# Altium schematic sheet OmniBotRemote.SchDoc
size A3
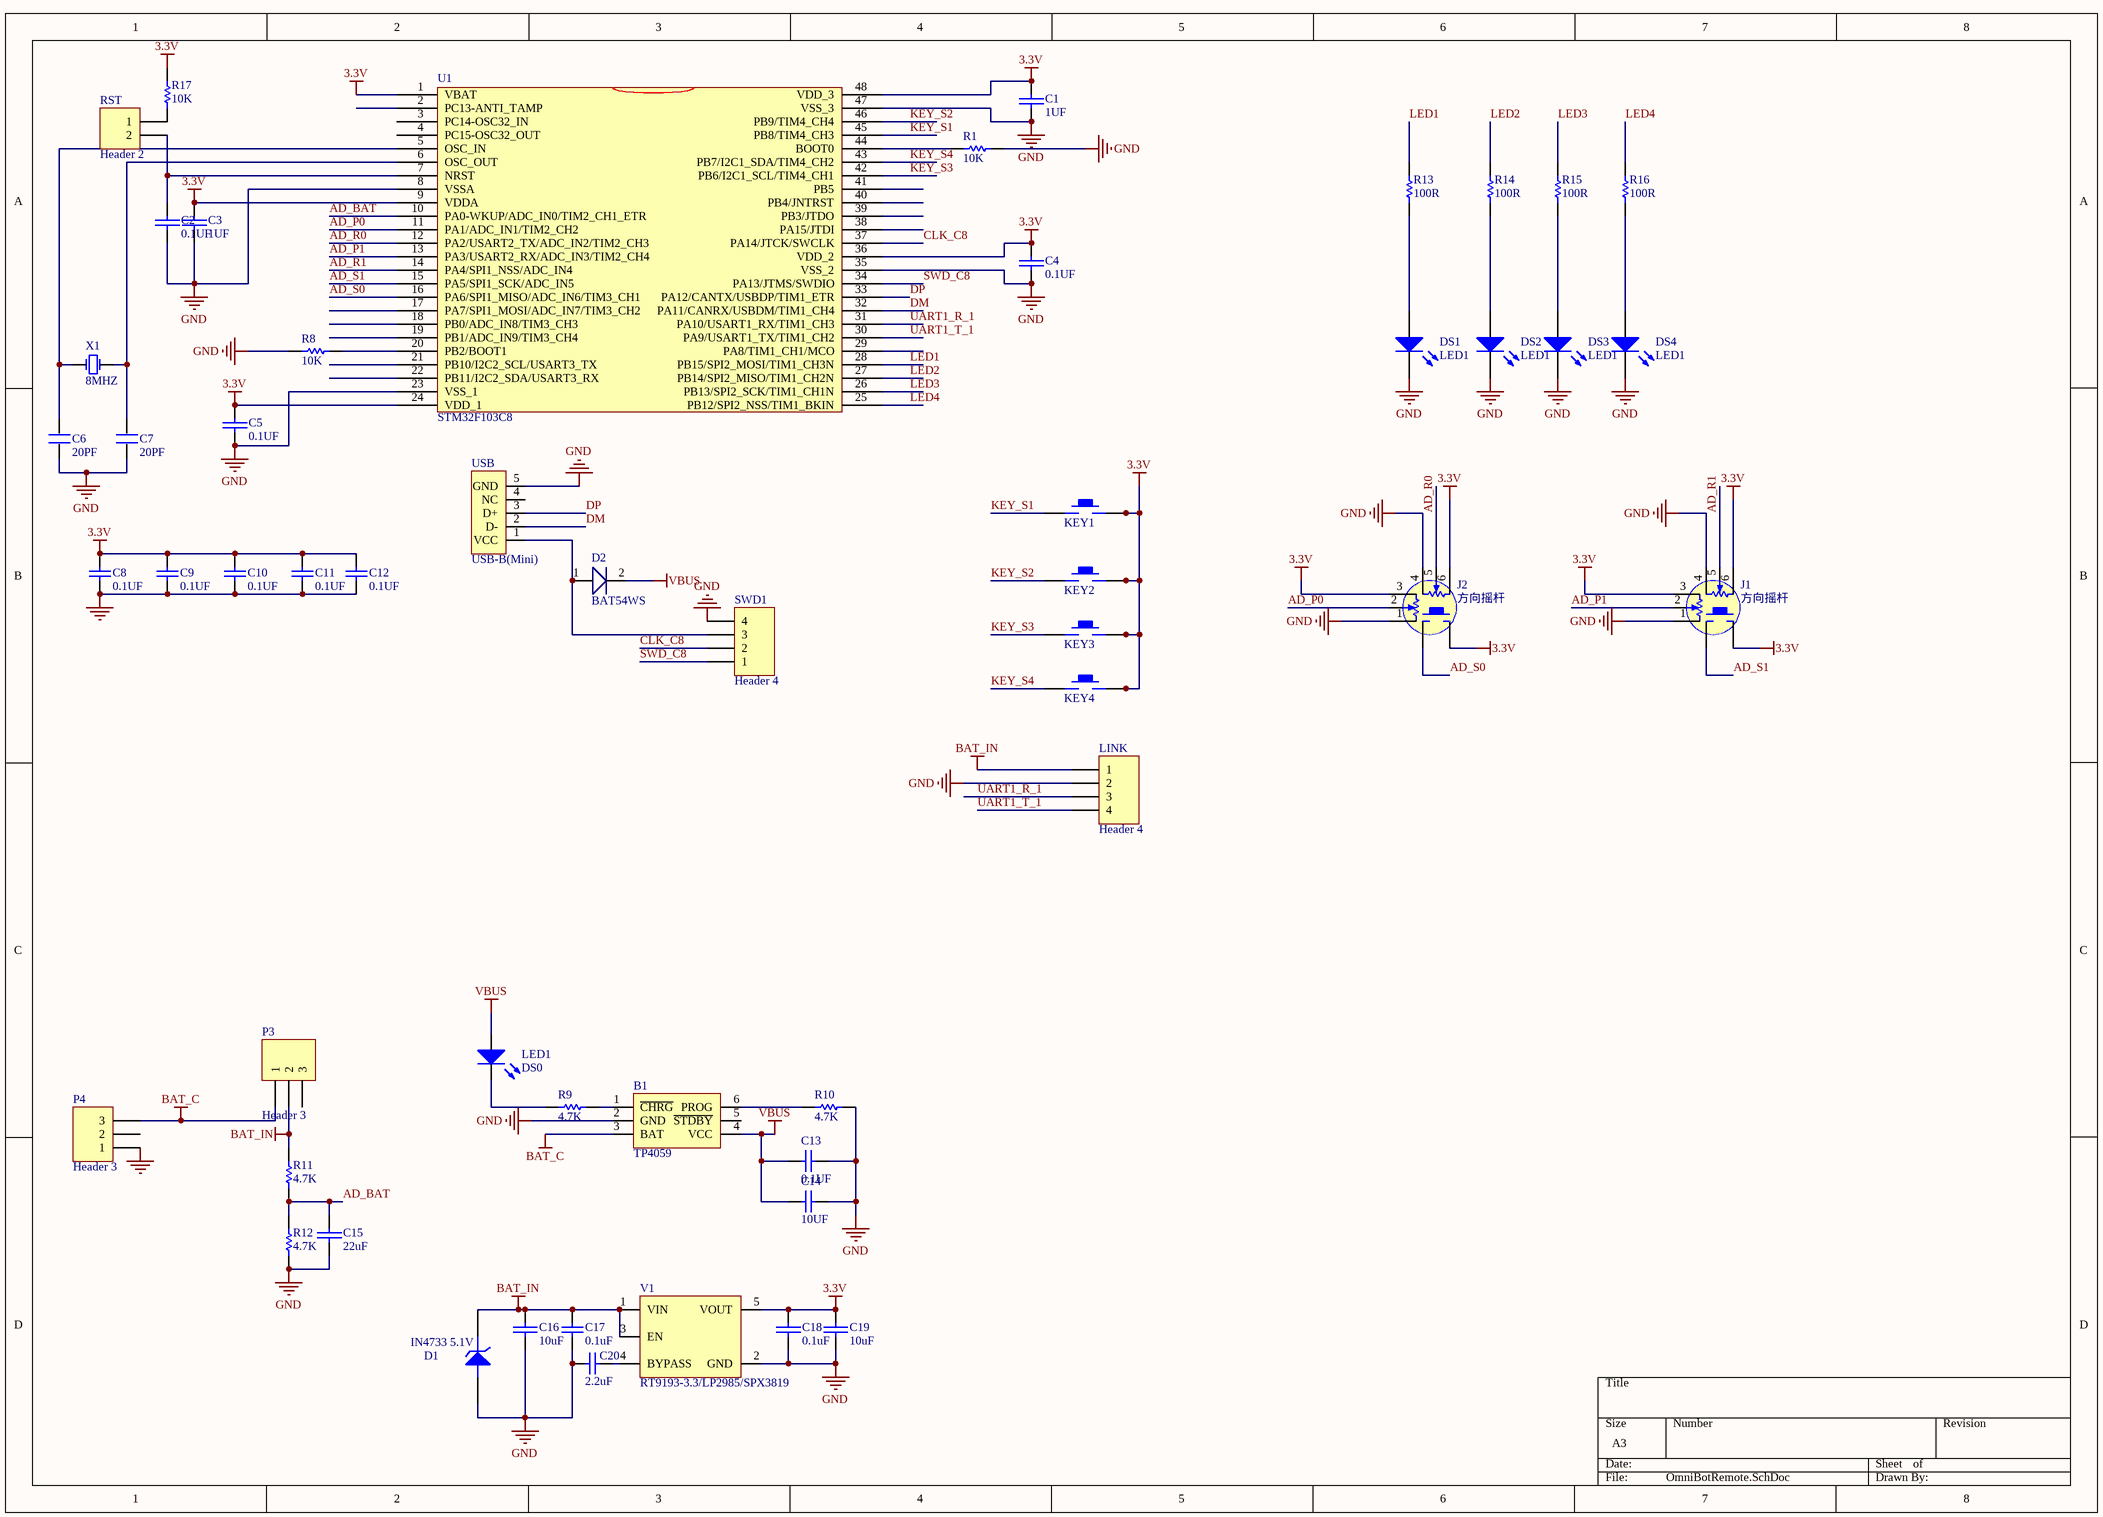
[diagram p0: OmniBotRemote.SchDoc]

## Parts
B1  TP4059  [SOT23-6S]
C1  1UF  [C 0402]
C2  0.1UF  [C 0402]
C3  1UF  [C 0402]
C4  0.1UF  [C 0402]
C5  0.1UF  [C 0402]
C6  20PF  [C 0402]
C7  20PF  [C 0402]
C8  0.1UF  [C 0402]
C9  0.1UF  [C 0402]
C10  0.1UF  [C 0402]
C11  0.1UF  [C 0402]
C12  0.1UF  [C 0402]
C13  0.1UF  [C0603]
C14  10UF  [C0603]
C15  22uF  [C 0402]
C16  10uF  [C0603]
C17  0.1uF  [C 0402]
C18  0.1uF  [C 0402]
C19  10uF  [C0603]
C20  value 2.2uF  [C 0402]  (hidden comment: 0.1uF)
D1  IN4733 5.1V  [1n4148-SOD123]
D2  BAT54WS  [SOD-323]
DS1  LED1  [SMDLED]
DS2  LED1  [SMDLED]
DS3  LED1  [SMDLED]
DS4  LED1  [SMDLED]
J1  方向摇杆  [摇杆2]
J2  方向摇杆  [摇杆2]
KEY1  KEY_M  [KEY_M]  (value not drawn)
KEY2  KEY_M  [KEY_M]  (value not drawn)
KEY3  KEY_M  [KEY_M]  (value not drawn)
KEY4  KEY_M  [KEY_M]  (value not drawn)
LED1  DS0  [LED_0603]
LINK  Header 4  [HDR2X2]
P3  Header 3  [HDR1X3]
P4  Header 3  [HDR1X3]
R1  value 10K  [R 0402]  (hidden comment: 1K)
R8  value 10K  [R 0402]  (hidden comment: 1K)
R9  value 4.7K  [R0603]  (hidden comment: 1K)
R10  value 4.7K  [R0603]  (hidden comment: 1K)
R11  4.7K  [R 0402]
R12  4.7K  [R 0402]
R13  100R  [R0603]
R14  100R  [R0603]
R15  100R  [R0603]
R16  100R  [R0603]
R17  10K  [R0603]
RST  Header 2  [KEY_SAD]
SWD1  Header 4  [SH1.0-4P - up]
U1  STM32F103C8  [LQFP48S]
USB  USB-B(Mini)  [USB/SM0.8-6H5_M]
V1  RT9193-3.3/LP2985/SPX3819  [SOT23-5]
X1  8MHZ  [PXCL]

## Nets
3.3V: C1.2 C3.2 C4.2 C5.2 C8.1 C9.1 C10.1 C11.1 C12.1 C18.1 C19.1 J1.3 J1.6 J1.J1 J2.3 J2.6 J2.J1 KEY1.2 KEY2.2 KEY3.2 KEY4.2 R17.2 U1.1(VBAT) U1.9(VDDA) U1.24(VDD_1) U1.36(VDD_2) U1.48(VDD_3) V1.5(VOUT)
BAT_C: B1.3(BAT) P3.1 P4.3
BAT_IN: C16.1 C17.2 D1.2(K) LINK.1 P3.2 R11.1 V1.1(VIN) V1.3(EN)
GND: B1.2(GND) C1.1 C2.1 C3.1 C4.1 C5.1 C6.1 C7.1 C8.2 C9.2 C10.2 C11.2 C12.2 C13.1 C14.1 C15.2 C16.2 C17.1 C18.2 C19.2 C20.2 D1.1(A) DS1.2(K) DS2.2(K) DS3.2(K) DS4.2(K) J1.1 J1.4 J2.1 J2.4 LINK.2 P4.1 R1.2 R8.1 R10.1 R12.1 SWD1.4 U1.8(VSSA) U1.23(VSS_1) U1.35(VSS_2) U1.47(VSS_3) USB.5(GND) V1.2(GND)
VBUS: B1.4(VCC) C13.2 C14.2 D2.2 LED1.1(A)
AD_BAT: C15.1 R11.2 R12.2 U1.10(PA0-WKUP/ADC_IN0/TIM2_CH1_ETR)
AD_P0: J2.2 U1.11(PA1/ADC_IN1/TIM2_CH2)
AD_P1: J1.2 U1.13(PA3/USART2_RX/ADC_IN3/TIM2_CH4)
AD_R0: J2.5 U1.12(PA2/USART2_TX/ADC_IN2/TIM2_CH3)
AD_R1: J1.5 U1.14(PA4/SPI1_NSS/ADC_IN4)
AD_S0: J2.J2 U1.16(PA6/SPI1_MISO/ADC_IN6/TIM3_CH1)
AD_S1: J1.J2 U1.15(PA5/SPI1_SCK/ADC_IN5)
CLK_C8: SWD1.2 U1.37(PA14/JTCK/SWCLK)
DM: U1.32(PA11/CANRX/USBDM/TIM1_CH4) USB.2(D-)
DP: U1.33(PA12/CANTX/USBDP/TIM1_ETR) USB.3(D+)
KEY_S1: KEY1.1 U1.45(PB8/TIM4_CH3)
KEY_S2: KEY2.1 U1.46(PB9/TIM4_CH4)
KEY_S3: KEY3.1 U1.42(PB6/I2C1_SCL/TIM4_CH1)
KEY_S4: KEY4.1 U1.43(PB7/I2C1_SDA/TIM4_CH2)
LED1: R13.1 U1.28(PB15/SPI2_MOSI/TIM1_CH3N)
LED2: R14.1 U1.27(PB14/SPI2_MISO/TIM1_CH2N)
LED3: R15.1 U1.26(PB13/SPI2_SCK/TIM1_CH1N)
LED4: R16.1 U1.25(PB12/SPI2_NSS/TIM1_BKIN)
SWD_C8: SWD1.1 U1.34(PA13/JTMS/SWDIO)
UART1_R_1: LINK.3 U1.31(PA10/USART1_RX/TIM1_CH3)
UART1_T_1: LINK.4 U1.30(PA9/USART1_TX/TIM1_CH2)
NetB1_1: B1.1(~{CHRG}) R9.1
NetB1_6: B1.6(PROG) R10.2
NetC2_2: C2.2 RST.2 U1.7(NRST)
NetC6_2: C6.2 U1.5(OSC_IN) X1.1(OSC1)
NetC7_2: C7.2 U1.6(OSC_OUT) X1.2(OSC2)
NetC20_1: C20.1 V1.4(BYPASS)
NetD2_1: D2.1 SWD1.3 USB.1(VCC)
NetDS1_1: DS1.1(A) R13.2
NetDS2_1: DS2.1(A) R14.2
NetDS3_1: DS3.1(A) R15.2
NetDS4_1: DS4.1(A) R16.2
NetLED1_2: LED1.2(K) R9.2
NetR1_1: R1.1 U1.44(BOOT0)
NetR8_2: R8.2 U1.20(PB2/BOOT1)
NetR17_1: R17.1 RST.1

Not connected (* = marked no-connect by the designer): B1 5(~{STDBY}); P3 3; P4 2; U1 2(PC13-ANTI_TAMP) 3(PC14-OSC32_IN) 4(PC15-OSC32_OUT) 17(PA7/SPI1_MOSI/ADC_IN7/TIM3_CH2) 18(PB0/ADC_IN8/TIM3_CH3) 19(PB1/ADC_IN9/TIM3_CH4) 21(PB10/I2C2_SCL/USART3_TX) 22(PB11/I2C2_SDA/USART3_RX) 29(PA8/TIM1_CH1/MCO) 38(PA15/JTDI) 39(PB3/JTDO) 40(PB4/JNTRST) 41(PB5); USB 4(NC)

## Library data of the parts
C1-C5 C15 C16 C18 C19 = CAP: Capacitor
C6 C7 = C2: 0805
C8-C14 = CAP: Capacitor; Value: 100nF; Published: 8-Jun-2000; Revision: July-2002: Re-released for DXP Platform.; Publisher: Altium Limited
C17 C20 = Capacitor: 普通电容; Published: 8-Jun-2000; LatestRevisionDate: 17-Jul-2002; LatestRevisionNote: Re-released for DXP Platform.; PackageReference: RAD-0.3; Publisher: Altium Limited
  C17: Value: 0.1uF
D1 = ZENER3: Zener Diode
D2 = BAT54: 单肖特基二极管
DS1-DS4 = LED2: Typical RED, GREEN, YELLOW, AMBER GaAs LED; Published: 8-Jun-2000; LatestRevisionDate: 17-Jul-2002; LatestRevisionNote: Re-released for DXP Platform.; PackageDocument: Feb-2002; PackageReference: 3.2X1.6X1.1; Publisher: Altium Limited
J1 J2 = 摇杆_1: 摇杆
LED1 = LED: Typical RED, GREEN, YELLOW, AMBER GaAs LED; Published: 8-Jun-2000; LatestRevisionDate: 17-Jul-2002; LatestRevisionNote: Re-released for DXP Platform.; PackageDocument: Feb-2002; PackageReference: 3.2X1.6X1.1; Publisher: Altium Limited
LINK SWD1 = Header 4: Header, 4-Pin; LatestRevisionDate: 17-Jul-2002; LatestRevisionNote: Re-released for DXP Platform.; Publisher: Altium Limited
P3 P4 = Header 3: Header, 3-Pin; LatestRevisionDate: 17-Jul-2002; LatestRevisionNote: Re-released for DXP Platform.; Publisher: Altium Limited
R1 R8-R10 = Res1: Resistor; Published: 8-Jun-2000; Revision: July-2002: Re-released for DXP Platform.; Publisher: Altium Limited
R11-R17 = Res2: 0603
RST = Header 2: Header, 2-Pin; LatestRevisionDate: 17-Jul-2002; LatestRevisionNote: Re-released for DXP Platform.; Publisher: Altium Limited
U1 = STM32F103C6
USB = USB5
V1 = RT9193-3.3/LP2985/SPX3819: 降压IC
X1 = XTAL: Crystal Oscillator; Published: 8-Jun-2000; LatestRevisionDate: 17-Jul-2002; LatestRevisionNote: Re-released for DXP Platform.; Publisher: Altium Limited